# EasyEDA Pro project GController.eprj, board PCB1
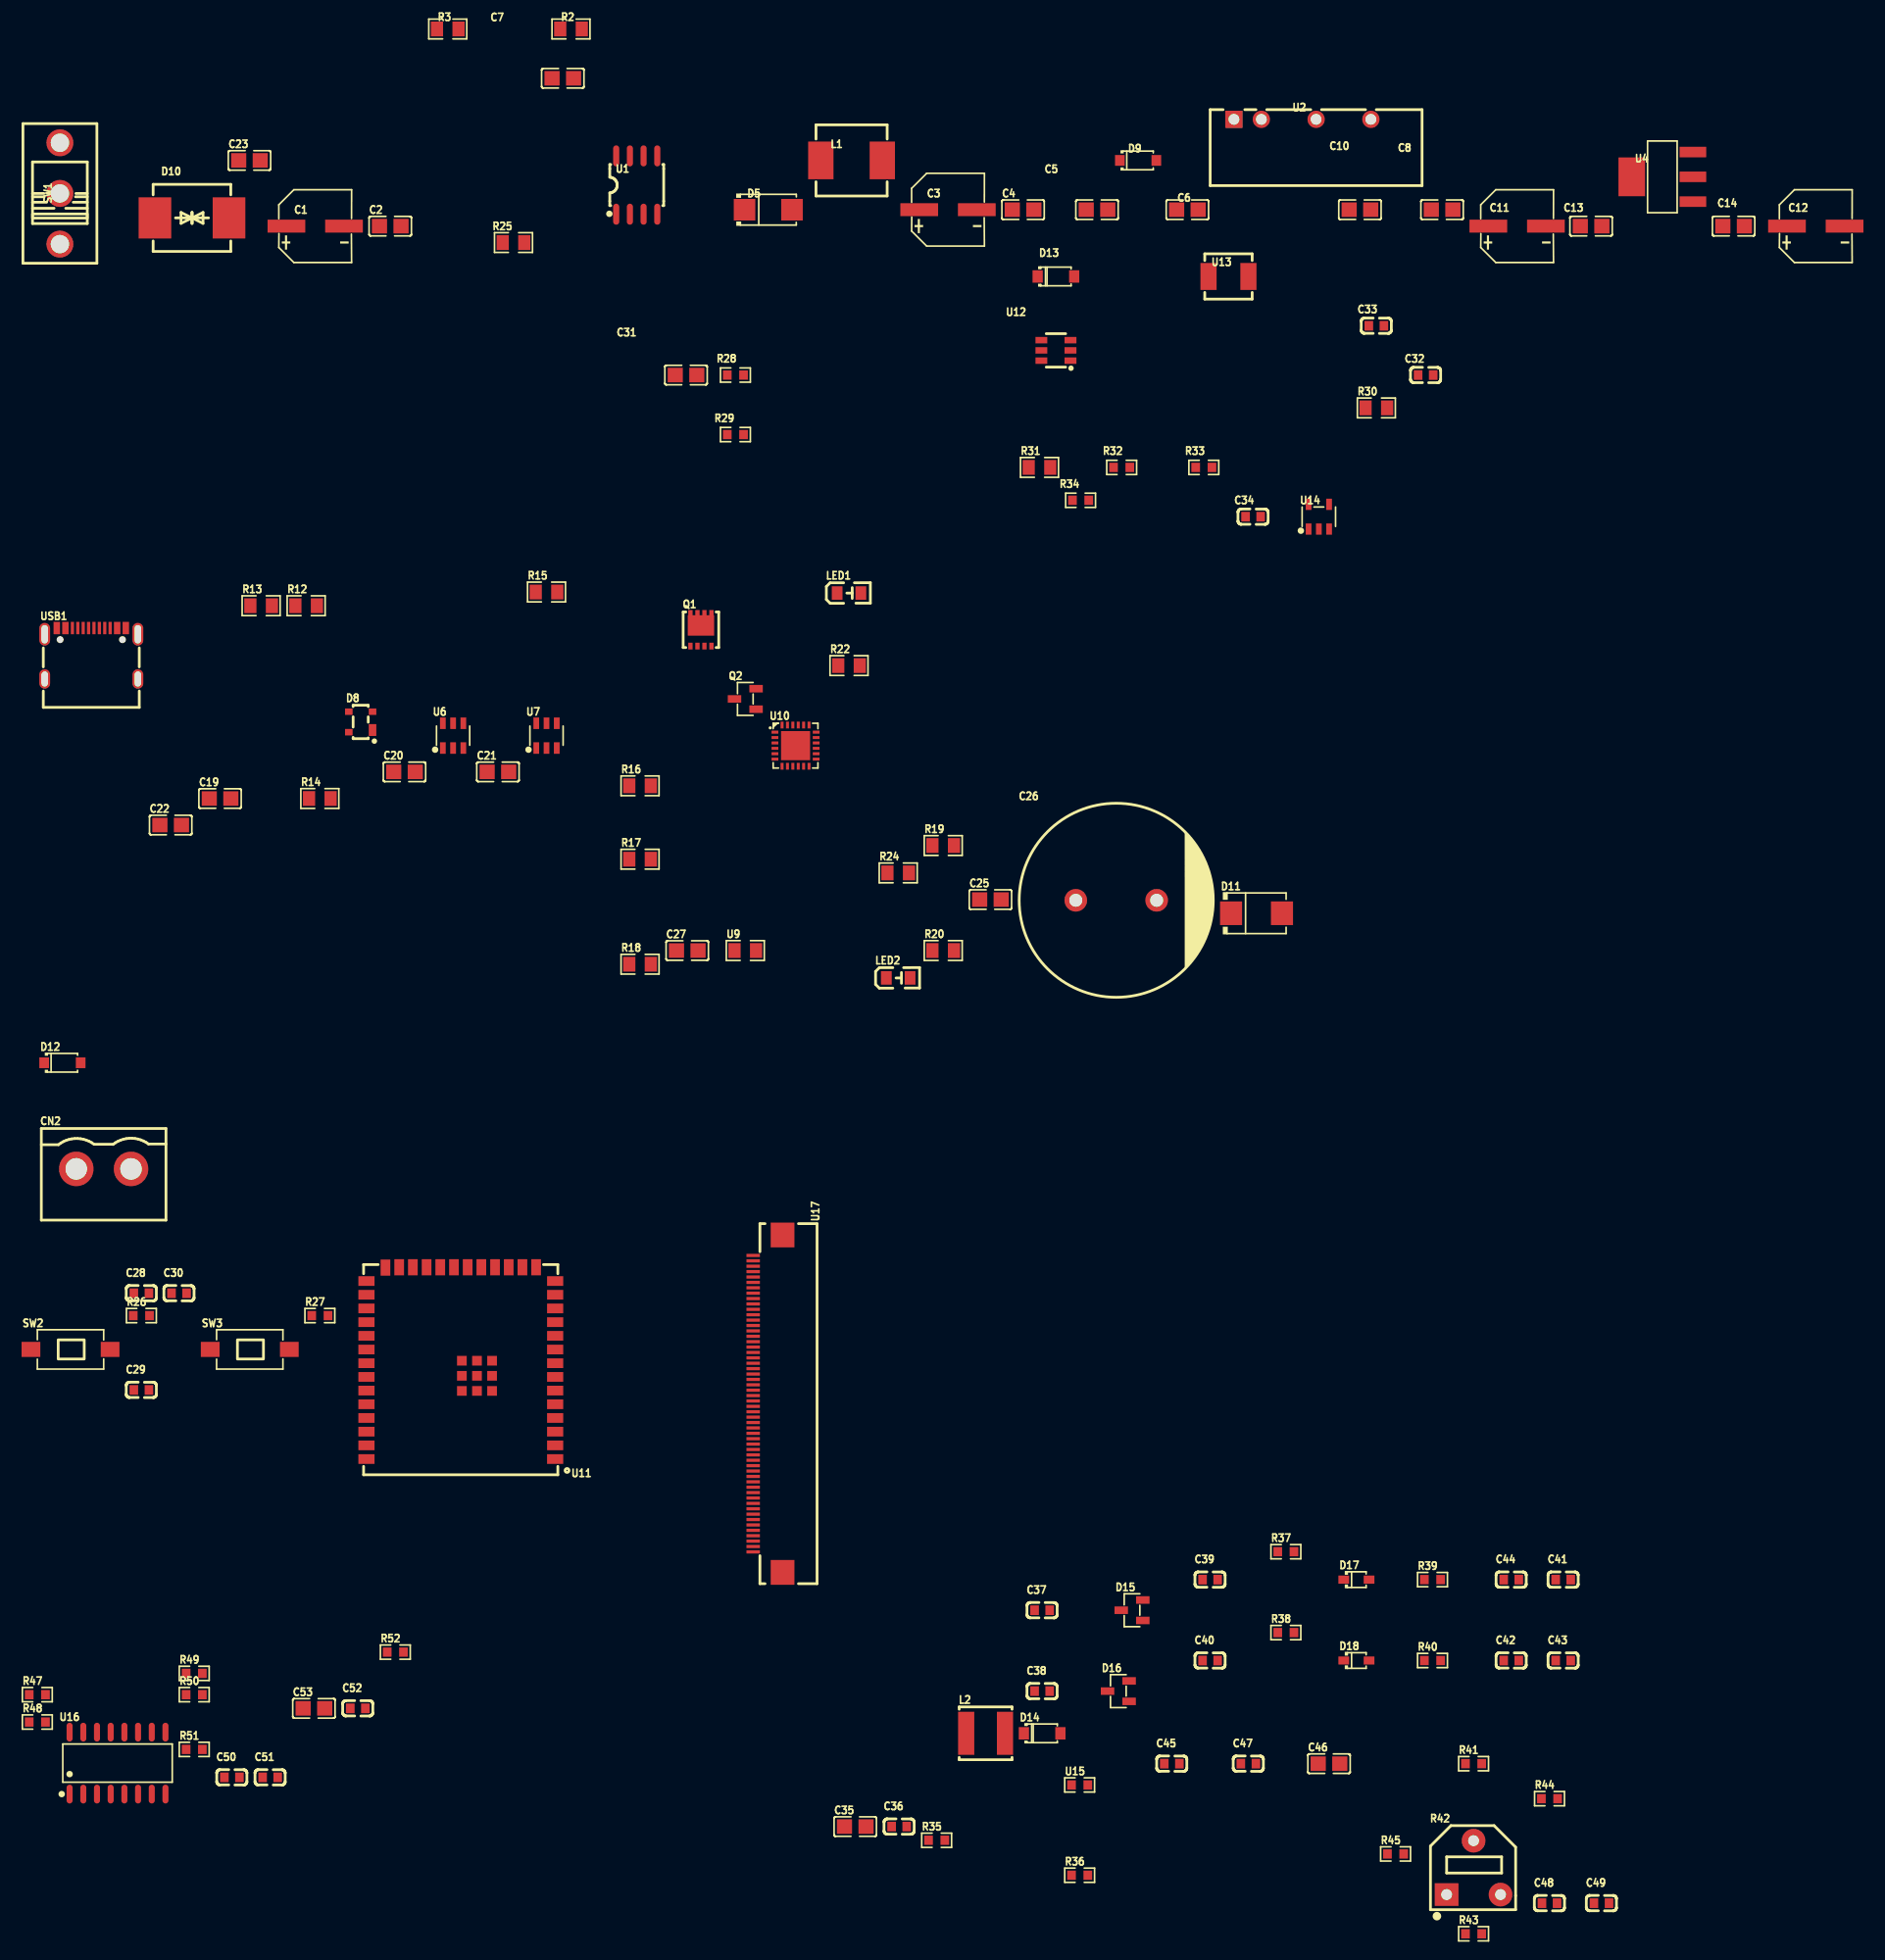
[diagram p4: board, top side]
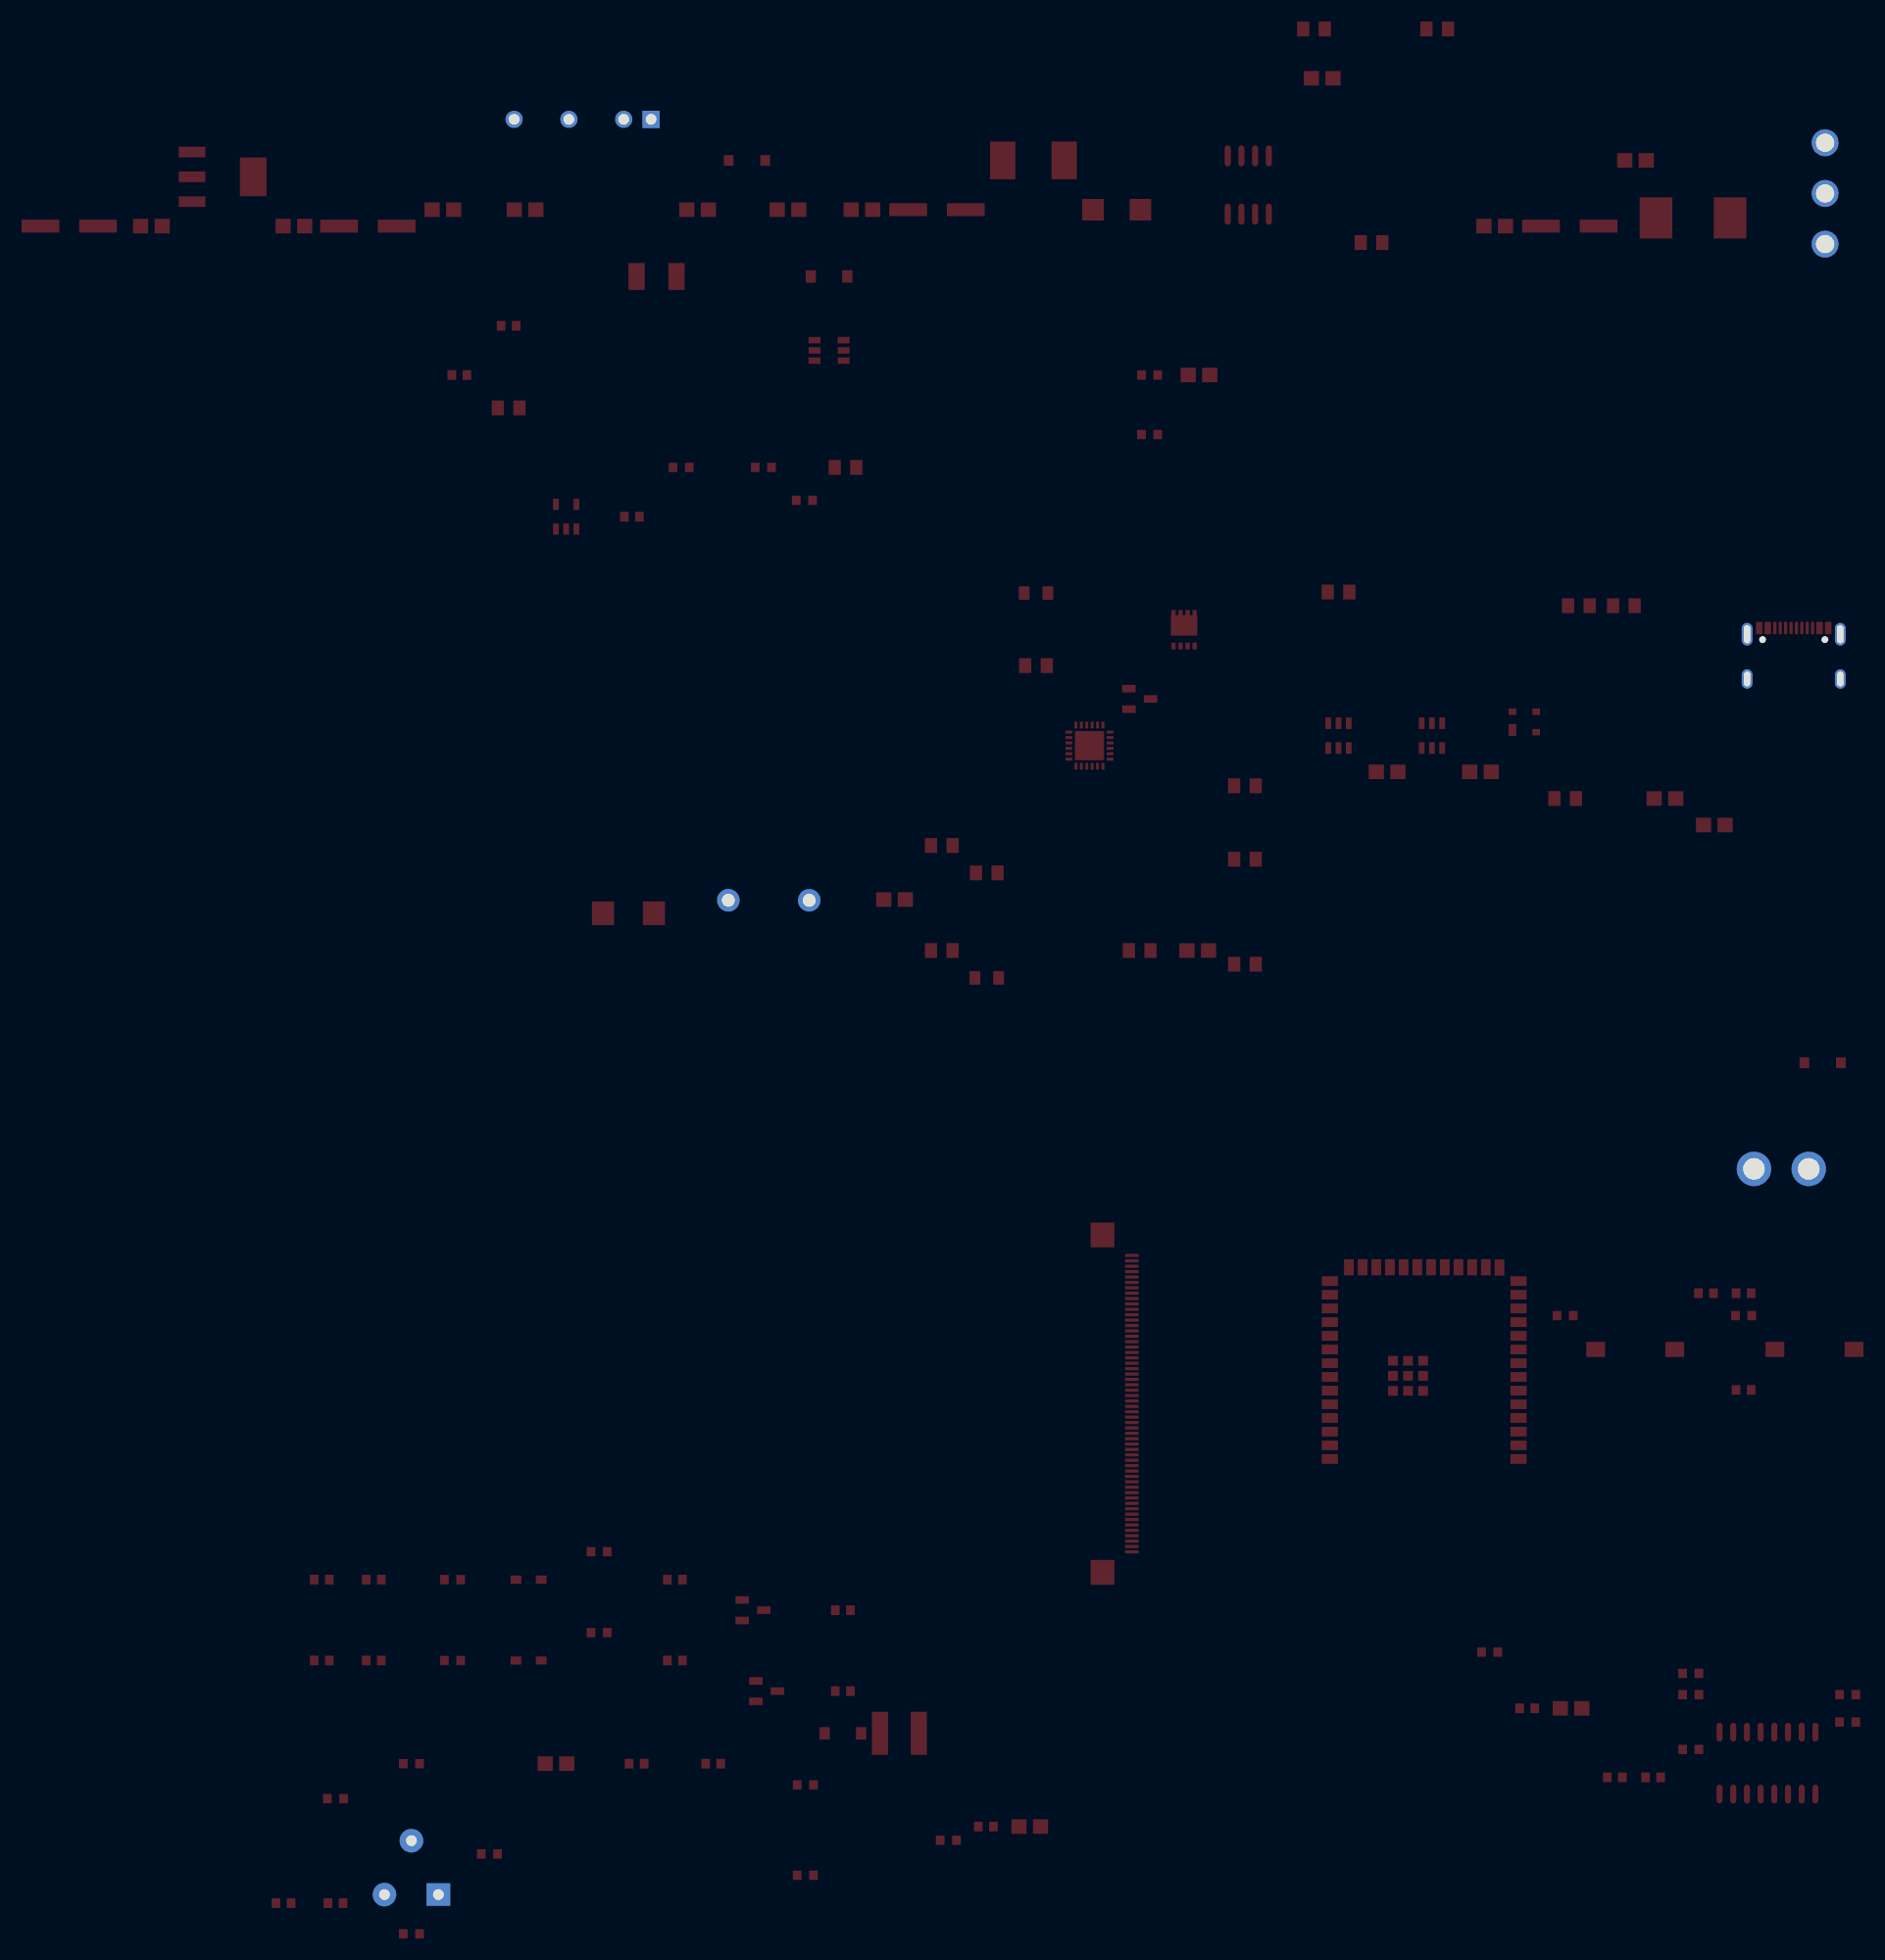
[diagram p5: board, bottom side, seen from below]

Outline 6.42 x 0.64 mm; copper layers: Top Layer, Bottom Layer. Coordinates in mm from the lower left corner of the outline.
Stack: Top Layer 0.035mm / Dielectric1 1.51mm FR4 er 4.5 / Bottom Layer 0.035mm

## Design rules (mm)
template: JLCPCB Capability(Two Layers Board)
spacing copperThickness1oz (default): track to track 0.102, other pairs 0.152 to 0.3
spacing copperThickness2oz: track to track 0.203, other pairs 0.152 to 0.3
track width copperThickness1oz (default): min 0.127, default 0.254, max 2.54
track width copperThickness2oz: min 0.203, default 0.254, max 2.54
differential pair differentialPair (default): width min 0.127, default 0.254, max 2.54; gap min 0.152, default 0.152
via viaSize (default): diameter min 0.5, default 0.61, max 10; hole min 0.3, default 0.305, max 6.3

## Placement (name value [footprint] x y rotation side)
C1  10uF  [CAP-SMD_BD6.3-L6.6-W6.6-FD]  23.98 38.68 0 top
C2  1uF  [C0805]  30.94 38.68 0 top
C3  100uF  [CAP-SMD_BD6.3-L6.6-W6.6-FD]  82.67 40.2 0 top
C4  22uF  [C0805]  89.63 40.2 0 top
C5  22uF  [C0805]  96.49 40.2 0 top
C6  10uF  [C0805]  104.87 40.2 0 top
C7  3.3nF  [C0805]  46.94 52.4 0 top
C8  10uF  [C0805]  120.87 40.2 180 top
C10  100nF  [C0805]  128.49 40.2 0 top
C11  220uF  [CAP-SMD_BD6.3-L6.6-W6.6-LS7.2-FD]  135.45 38.68 0 top
C12  220uF  [CAP-SMD_BD6.3-L6.6-W6.6-LS7.2-FD]  163.15 38.68 0 top
C13  10uF  [C0805]  142.31 38.68 0 top
C14  10uF  [C0805]  155.53 38.68 0 top
C19  4.7nF  [C0805]  15.15 -14.42 0 top
C20  100nF  [C0805]  32.26 -11.95 0 top
C21  100nF  [C0805]  40.92 -11.95 0 top
C22  100nF  [C0805]  10.57 -16.88 0 top
C23  1uF  [C0805]  17.88 44.78 0 top
C25  1uF  [C0805]  86.6 -23.79 0 top
C26  1000uF  [CAP-TH_BD18.0-P7.50-D0.8-FD]  98.27 -23.86 0 top
C27  22nF  [C0805]  58.48 -28.52 0 top
C28  1uF  [C0603]  7.86 -60.31 0 top
C29  1uF  [C0603]  7.86 -69.28 0 top
C30  100nF  [C0603]  11.35 -60.31 0 top
C31  10uF  [C0805]  58.37 24.87 0 top
C32  1uF  [C0603]  126.97 24.87 0 top
C33  100nF  [C0603]  122.39 29.44 0 top
C34  100nF  [C0603]  110.96 11.72 0 top
C35  10uF  [C0805]  74.07 -109.79 0 top
C36  1uF  [C0603]  78.14 -109.79 0 top
C37  100nF  [C0603]  91.4 -89.72 0 top
C38  100nF  [C0603]  91.4 -97.22 0 top
C39  1uF  [C0603]  106.98 -86.88 0 top
C40  1uF  [C0603]  106.98 -94.38 0 top
C41  1uF  [C0603]  139.72 -86.88 0 top
C42  1uF  [C0603]  134.9 -94.38 0 top
C43  100nF  [C0603]  139.72 -94.38 0 top
C44  100nF  [C0603]  134.9 -86.88 0 top
C45  1uF  [C0603]  103.43 -103.95 0 top
C46  10uF  [C0805]  118 -103.95 0 top
C47  100nF  [C0603]  110.52 -103.95 0 top
C48  100nF  [C0603]  138.45 -116.89 0 top
C49  1uF  [C0603]  143.27 -116.89 0 top
C50  1uF  [C0603]  16.25 -105.22 0 top
C51  100nF  [C0603]  19.8 -105.22 0 top
C52  100nF  [C0603]  27.93 -98.82 0 top
C53  10uF  [C0805]  23.86 -98.82 0 top
CN2  DB2EVC-5.08-2P-GN  [CONN-TH_2P-P5.08_DB2EVC-5.08-2P]  4.36 -48.78 0 top
D5  SS34  [SMA_L4.3-W2.6-LS5.2-RD]  66 40.2 0 top
D8  PRTR5V0U2X,215  [SOT-143_L2.9-W1.3-P1.92-LS2.3-BR]  28.2 -7.32 0 top
D9  PMEG6020AELRX  [SOD-123_L2.6-W1.7-LS3.5-RD]  100.3 44.78 0 top
D10  SMCJ36CA  [SMC_L6.9-W5.9-LS7.9-BI]  12.55 39.44 0 top
D11  B260-13-F  [SMB_L4.6-W3.6-LS5.3-RD]  111.28 -25.06 0 top
D12  PMEG6020AELRX  [SOD-123_L2.6-W1.7-LS3.5-RD]  0.53 -38.93 0 top
D13  1N5819W  [SOD-123_L2.8-W1.8-LS3.7-RD]  92.68 34.01 0 top
D14  1N5819W  [SOD-123_L2.8-W1.8-LS3.7-RD]  91.4 -101.14 0 top
D15  BAT54S  [SOT-23-3_L2.9-W1.3-P1.90-LS2.4-BR]  99.73 -89.72 0 top
D16  BAT54S  [SOT-23-3_L2.9-W1.3-P1.90-LS2.4-BR]  98.46 -97.22 0 top
D17  BZT52C18S  [SOD-323_L1.8-W1.3-LS2.5-RD]  120.54 -86.88 0 top
D18  BZT52C18S  [SOD-323_L1.8-W1.3-LS2.5-RD]  120.54 -94.38 0 top
L1  47uH  [IND-SMD_L7.2-W6.6_GPSR07X0]  73.72 44.78 0 top
L2  22uH  [IND-SMD_L4.9-W4.9_NRS50XX]  86.15 -101.14 0 top
LED1  XL-2012SURC  [LED0805-RD_RED]  73.49 4.64 0 top
LED2  XL-2012UGC  [LED0805-RD_GREEN]  78.05 -31.06 0 top
Q1  CSD19537Q3T  [VSONP-8_L3.3-W3.3-P0.65-BL]  59.75 1.24 0 top
Q2  BSS138  [SOT-23-3_L2.9-W1.3-P1.90-LS2.4-BR]  63.87 -5.18 0 top
R2  41.2kΩ  [R0805]  47.7 56.97 0 top
R3  12kΩ  [R0805]  36.27 56.97 0 top
R12  5.1kΩ  [R0805]  23.14 3.47 0 top
R13  5.1kΩ  [R0805]  18.96 3.47 0 top
R14  1MΩ  [R0805]  24.41 -14.42 0 top
R15  100kΩ  [R0805]  45.43 4.74 0 top
R16  887kΩ  [R0805]  54.11 -13.24 0 top
R17  29.4kΩ  [R0805]  54.11 -20.05 0 top
R18  34kΩ  [R0805]  54.11 -29.79 0 top
R19  499kΩ  [R0805]  82.22 -18.78 0 top
R20  56kΩ  [R0805]  82.22 -28.52 0 top
R22  49.9kΩ  [R0805]  73.49 -2.09 0 top
R24  24.3kΩ  [R0805]  78.05 -21.32 0 top
R25  47kΩ  [R0805]  42.37 37.16 0 top
R26  10kΩ  [R0603]  7.86 -62.38 0 top
R27  10kΩ  [R0603]  24.41 -62.38 0 top
R28  4.7kΩ  [R0603]  62.95 24.87 0 top
R29  100kΩ  [R0603]  62.95 19.34 0 top
R30  1.8Ω  [R0805]  122.39 21.82 0 top
R31  1.6Ω  [R0805]  91.15 16.3 0 top
R32  5.1kΩ  [R0603]  98.77 16.3 0 top
R33  68kΩ  [R0603]  106.39 16.3 0 top
R34  10kΩ  [R0603]  94.96 13.25 0 top
R35  10kΩ  [R0603]  81.62 -111.06 0 top
R36  4.7kΩ  [R0603]  94.88 -114.3 0 top
R37  1kΩ  [R0603]  114 -84.29 0 top
R38  1kΩ  [R0603]  114 -91.79 0 top
R39  10kΩ  [R0603]  127.6 -86.88 0 top
R40  47kΩ  [R0603]  127.6 -94.38 0 top
R41  15kΩ  [R0603]  131.41 -103.95 0 top
R42  10kΩ  [RES-ADJ-SMD_RM065-V1]  131.41 -113.6 0 top
R43  6.8kΩ  [R0603]  131.41 -119.73 0 top
R44  0Ω  [R0603]  138.45 -107.2 0 top
R45  0Ω  [R0603]  124.18 -112.33 0 top
R47  10kΩ  [R0603]  -1.79 -97.55 0 top
R48  10kΩ  [R0603]  -1.79 -100.09 0 top
R49  10kΩ  [R0603]  12.76 -95.58 0 top
R50  10kΩ  [R0603]  12.76 -97.55 0 top
R51  10kΩ  [R0603]  12.76 -102.63 0 top
R52  10kΩ  [R0603]  31.41 -93.6 0 top
SW1  SS-12D10G5  [SW-TH_SS-12D10L9]  0.3 41.71 90 top
SW2  TS-1101S-C-B-B-B-A  [SW-SMD_L6.0-W3.5-LS8.0]  1.29 -65.52 0 top
SW3  TS-1101S-C-B-B-B-A  [SW-SMD_L6.0-W3.5-LS8.0]  17.91 -65.52 0 top
U1  XL1509-ADJE1  [SOIC-8_L5.0-W4.0-P1.27-LS6.0-BL]  53.8 42.49 0 top
U2  B0505S-3WR2  [PWRM-TH_B0505S-3WR2]  115.54 48.59 0 top
U4  AMS1117-3.3  [SOT-223-4_L6.5-W3.5-P2.30-LS7.0-BR]  148.92 43.25 0 top
U6  SN74LVC1G3157DBVR  [SOT-23-6_L2.9-W1.6-P0.95-LS2.8-BL]  36.77 -8.59 0 top
U7  SN74LVC1G3157DBVR  [SOT-23-6_L2.9-W1.6-P0.95-LS2.8-BL]  45.43 -8.59 0 top
U9  9.09kΩ  [R0805]  63.87 -28.52 0 top
U10  TPS26630RGER  [VQFN-24_L4.0-W4.0-P0.50-TL-EP2.7]  68.53 -9.51 0 top
U11  ESP32-S3-WROOM-1U-N8R8  [WIRELM-SMD_ESP32-S3-WROOM-1U]  37.48 -66.8 180 top
U12  AP3032KTR-G1  [SOT-23-6_L2.9-W1.6-P0.95-LS2.8-BR]  92.68 27.15 0 top
U13  10uH  [IND-SMD_L4.4-W4.2_BCIHP0412SC]  108.68 34.01 0 top
U14  AP3012KTR-G1  [TSOT-23-5_L2.9-W1.6-P0.95-LS2.8-BL]  117.06 11.72 0 top
U15  33kΩ  [R0603]  94.88 -105.93 0 top
U16  CH422G  [SOP-16_L10.0-W3.9-P1.27-LS6.0-BL]  5.65 -103.9 0 top
U17  AFD01-S56FCA-00  [FPC-SMD_56P-P0.50_JS_AFD01-S56FCA-00]  65.96 -70.56 270 top
USB1  TYPE-C16PIN  [USB-C-SMD_TYPE-C16PIN]  3.21 -0.97 0 top

## Footprints (pads in the part's own frame, mm; a bottom-side part is the same pattern mirrored in y, then rotated)
C0603
  rect 0.8x0.9 smd: 1(-0.7,0) 2(0.7,0)
C0805
  rect 1.41x1.35 smd: 1(-1,0) 2(1,0)
CAP-SMD_BD6.3-L6.6-W6.6-FD
  rect 3.5x1.2 smd: 1(-2.67,0) 2(2.67,0)
CAP-SMD_BD6.3-L6.6-W6.6-LS7.2-FD
  rect 3.5x1.2 smd: 1(-2.67,0) 2(2.67,0)
CAP-TH_BD18.0-P7.50-D0.8-FD
  round 2.1 hole 1.2: 1(-3.75,0) 2(3.75,0)
CONN-TH_2P-P5.08_DB2EVC-5.08-2P
  round 3.2 hole 2: 1(-2.54,0) 2(2.54,0)
FPC-SMD_56P-P0.50_JS_AFD01-S56FCA-00
  rect 0.3x1.25 smd: 1(-13.75,-1.363) 2(-13.25,-1.363) 3(-12.75,-1.363) 4(-12.25,-1.363) 5(-11.75,-1.363) 6(-11.25,-1.363) 7(-10.75,-1.363) 8(-10.25,-1.363) 9(-9.75,-1.363) 10(-9.25,-1.363) 11(-8.75,-1.363) 12(-8.25,-1.363) 13(-7.75,-1.363) 14(-7.25,-1.363) 15(-6.75,-1.363) 16(-6.25,-1.363) 17(-5.75,-1.363) 18(-5.25,-1.363) 19(-4.75,-1.363) 20(-4.25,-1.363) 21(-3.75,-1.363) 22(-3.25,-1.363) 23(-2.75,-1.363) 24(-2.25,-1.363) 25(-1.75,-1.363) 26(-1.25,-1.363) 27(-0.75,-1.363) 28(-0.25,-1.363) 29(0.25,-1.363) 30(0.75,-1.362) 31(1.25,-1.362) 32(1.75,-1.362) 33(2.25,-1.362) 34(2.75,-1.362) 35(3.25,-1.362) 36(3.75,-1.362) 37(4.25,-1.362) 38(4.75,-1.362) 39(5.25,-1.362) 40(5.75,-1.362) 41(6.25,-1.362) 42(6.75,-1.362) 43(7.25,-1.362) 44(7.75,-1.362) 45(8.25,-1.362) 46(8.75,-1.362) 47(9.25,-1.362) 48(9.75,-1.362) 49(10.25,-1.362) 50(10.75,-1.362) 51(11.25,-1.362) 52(11.75,-1.362) 53(12.25,-1.362) 54(12.75,-1.362) 55(13.25,-1.362) 56(13.75,-1.362)
  rect 2.3x2.2 smd: 57(15.65,1.363) 58(-15.65,1.363)
IND-SMD_L4.4-W4.2_BCIHP0412SC
  rect 1.5x2.5 smd: 1(-1.85,0) 2(1.85,0)
IND-SMD_L4.9-W4.9_NRS50XX
  rect 1.5x4 smd: 1(-1.8,0) 2(1.8,0)
IND-SMD_L7.2-W6.6_GPSR07X0
  rect 2.35x3.5 smd: 1(-2.85,0) 2(2.85,0)
LED0805-RD_GREEN
  rect 1x1.25 smd: 1(-1.1,0) 2(1.1,0)
LED0805-RD_RED
  rect 1x1.25 smd: 1(-1.1,0) 2(1.1,0)
PWRM-TH_B0505S-3WR2
  rect 1.6x1.6 hole 1: 1(-6.35,0)
  round 1.6 hole 1: 2(-3.81,0) 4(1.27,0) 6(6.35,0)
R0603
  rect 0.806x0.864 smd: 1(-0.753,0) 2(0.753,0)
R0805
  rect 1.133x1.377 smd: 1(-1,0) 2(1,0)
RES-ADJ-SMD_RM065-V1
  rect 2.2x2.1 hole 1: 1(-2.5,-2.5)
  round 2.2 hole 1: 2(0,2.5) 3(2.5,-2.5)
SMA_L4.3-W2.6-LS5.2-RD
  rect 2x2 smd: 1(-2.2,0) 2(2.2,0)
SMB_L4.6-W3.6-LS5.3-RD
  rect 2.047x2.192 smd: 1(-2.361,0) 2(2.361,0)
SMC_L6.9-W5.9-LS7.9-BI
  rect 3.03x3.82 smd: 1(-3.435,0) 2(3.435,0)
SOD-123_L2.6-W1.7-LS3.5-RD
  rect 0.9x1 smd: 1(-1.692,0) 2(1.692,0)
SOD-123_L2.8-W1.8-LS3.7-RD
  rect 0.95x1.15 smd: 1(-1.692,0) 2(1.692,0)
SOD-323_L1.8-W1.3-LS2.5-RD
  rect 1x0.75 smd: 1(-1.173,0) 2(1.173,0)
SOIC-8_L5.0-W4.0-P1.27-LS6.0-BL
  oval 0.569x1.95 smd: 1(-1.905,-2.705) 2(-0.635,-2.705) 3(0.635,-2.705) 4(1.905,-2.705) 5(1.905,2.705) 6(0.635,2.705) 7(-0.635,2.705) 8(-1.905,2.705)
SOP-16_L10.0-W3.9-P1.27-LS6.0-BL
  oval 0.56x1.745 smd: 1(-4.445,-2.873) 2(-3.175,-2.873) 3(-1.905,-2.873) 4(-0.635,-2.873) 5(0.635,-2.873) 6(1.905,-2.873) 7(3.175,-2.873) 8(4.445,-2.873) 9(4.445,2.873) 10(3.175,2.873) 11(1.905,2.873) 12(0.635,2.873) 13(-0.635,2.873) 14(-1.905,2.873) 15(-3.175,2.873) 16(-4.445,2.873)
SOT-23-3_L2.9-W1.3-P1.90-LS2.4-BR
  rect 1.25x0.7 smd: 1(1,-0.95) 2(1,0.95) 3(-1,0)
SOT-23-6_L2.9-W1.6-P0.95-LS2.8-BL
  rect 0.532x1.072 smd: 1(-0.95,-1.149) 2(0,-1.149) 3(0.95,-1.149) 4(0.95,1.149) 5(0,1.149) 6(-0.95,1.149)
SOT-23-6_L2.9-W1.6-P0.95-LS2.8-BR
  rect 1.1x0.6 smd: 1(1.35,-0.95) 2(1.35,0) 3(1.35,0.95) 4(-1.35,0.95) 5(-1.35,0) 6(-1.35,-0.95)
SOT-143_L2.9-W1.3-P1.92-LS2.3-BR
  rect 0.7x1.1 smd: 1(1.1,-0.75)
  rect 0.7x0.6 smd: 2(1.1,0.95) 3(-1.1,0.95) 4(-1.1,-0.95)
SOT-223-4_L6.5-W3.5-P2.30-LS7.0-BR
  rect 2.47x0.98 smd: 1(2.835,-2.3) 2(2.835,0) 3(2.835,2.3)
  rect 2.47x3.6 smd: 4(-2.835,0)
SW-SMD_L6.0-W3.5-LS8.0
  rect 1.74x1.4 smd: 1(-3.67,0) 2(3.67,0)
SW-TH_SS-12D10L9
  round 2.5 hole 1.7: 1(-4.7,0) 2(0,0) 3(4.7,0)
TSOT-23-5_L2.9-W1.6-P0.95-LS2.8-BL
  rect 0.532x1.045 smd: 1(-0.95,-1.147) 2(0,-1.147) 3(0.95,-1.147) 4(0.95,1.147) 5(-0.95,1.147)
USB-C-SMD_TYPE-C16PIN
  oval 1x2.1 hole 0.6x1.7: 1(-4.32,1.788) 2(4.32,1.788)
  oval 1x1.8 hole 0.6x1.4: 3(-4.32,-2.362) 4(4.32,-2.362)
  rect 0.6x1.15 smd: A1B12(-3.2,2.362) A4B9(-2.4,2.362) B1A12(3.2,2.362) B4A9(2.4,2.362)
  rect 0.3x1.15 smd: A5(-1.25,2.362) A6(-0.25,2.362) A7(0.25,2.362) A8(-1.75,2.362) B5(1.75,2.362) B6(0.75,2.362) B7(-0.75,2.362) B8(1.25,2.362)
VQFN-24_L4.0-W4.0-P0.50-TL-EP2.7
  rect 0.633x0.28 smd: 1(-1.911,1.25) 2(-1.911,0.75) 3(-1.911,0.25) 4(-1.911,-0.25) 5(-1.911,-0.75) 6(-1.911,-1.25) 13(1.911,-1.25) 14(1.911,-0.75) 15(1.911,-0.25) 16(1.911,0.25) 17(1.911,0.75) 18(1.911,1.25)
  rect 0.28x0.633 smd: 7(-1.25,-1.911) 8(-0.75,-1.911) 9(-0.25,-1.911) 10(0.25,-1.911) 11(0.75,-1.911) 12(1.25,-1.911) 19(1.25,1.911) 20(0.75,1.911) 21(0.25,1.911) 22(-0.25,1.911) 23(-0.75,1.911) 24(-1.25,1.911)
  rect 2.7x2.7 smd: 25(0,0)
VSONP-8_L3.3-W3.3-P0.65-BL
  rect 0.4x0.63 smd: 1(-0.975,-1.515) 2(-0.325,-1.515) 3(0.325,-1.515) 4(0.975,-1.515) 5(0.975,1.515) 6(0.325,1.515) 7(-0.325,1.515) 8(-0.975,1.515)
  rect 2.45x1.9 smd: 9(0,0.401)
WIRELM-SMD_ESP32-S3-WROOM-1U
  rect 1.5x0.9 smd: 1(-8.75,8.895) 2(-8.75,7.625) 3(-8.75,6.355) 4(-8.75,5.085) 5(-8.75,3.815) 6(-8.75,2.545) 7(-8.75,1.275) 8(-8.75,0.005) 9(-8.75,-1.265) 10(-8.75,-2.535) 11(-8.75,-3.805) 12(-8.75,-5.075) 13(-8.75,-6.345) 14(-8.75,-7.615) 27(8.75,-7.615) 28(8.75,-6.345) 29(8.75,-5.075) 30(8.75,-3.805) 31(8.75,-2.535) 32(8.75,-1.265) 33(8.75,0.005) 34(8.75,1.275) 35(8.75,2.545) 36(8.75,3.815) 37(8.75,5.085) 38(8.75,6.355) 39(8.75,7.625) 40(8.75,8.895)
  rect 0.9x1.5 smd: 15(-6.985,-8.895) 16(-5.715,-8.895) 17(-4.445,-8.895) 18(-3.175,-8.895) 19(-1.905,-8.895) 20(-0.635,-8.895) 21(0.635,-8.895) 22(1.905,-8.895) 23(3.175,-8.895) 24(4.445,-8.895) 25(5.715,-8.895) 26(6.985,-8.865)
  rect 0.9x0.9 smd: 41(-2.9,2.575) 41(-2.9,1.175) 41(-2.9,-0.225) 41(-1.5,2.575) 41(-1.5,1.175) 41(-1.5,-0.225) 41(-0.1,2.575) 41(-0.1,1.175) 41(-0.1,-0.225)

## Nets
As in the schematic, except:
CTP_SCL: U17.56
CTP_SDA: U17.55
IO8: U11.12 U16.6
IO9: U11.17 U16.5
$2N3841: R47.1 U16.2

Pads without a net: R52 2; U4 2; U10 12 13 19 20 21 22 23 24; U11 6 28 29 30; U16 1 4 8 9 10 11 12; U17 7 8 39 40 45 49 50; USB1 2 3 4 A8 B8
